# Altium schematic sheet altium.schdoc
size 226 x 97 mm
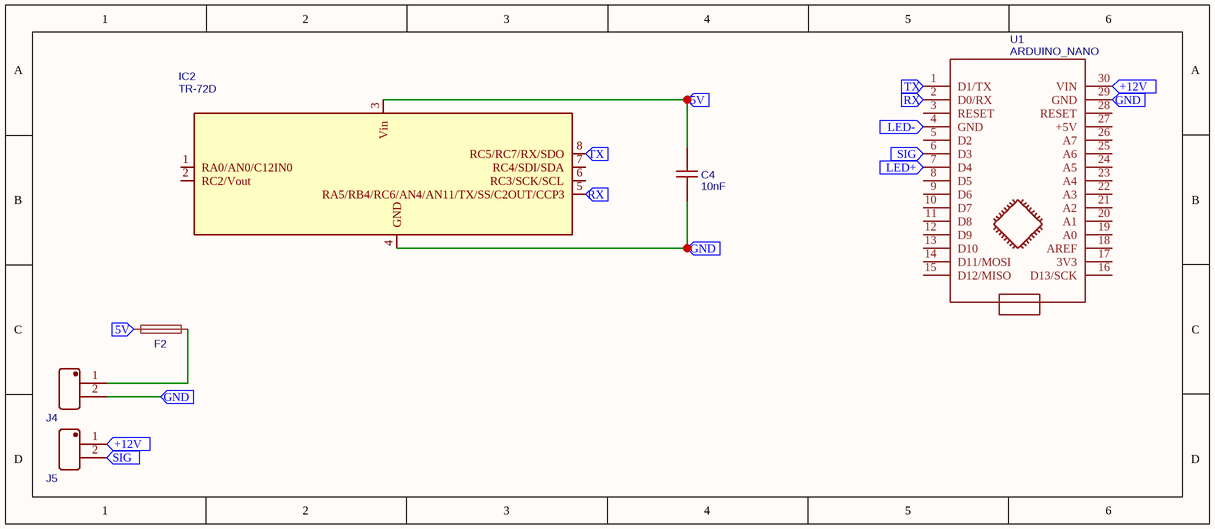
[diagram p0: altium.schdoc]

## Parts
C4  10nF  [0603]
F2  NO  [OMF_125]  (value not drawn)
IC2  TR-72D  [IQRF_KON-SIM-01]
J4  KF127_2P_5.08  [KF127_2P_5.08]  (value not drawn)
J5  KF127_2P_5.08  [KF127_2P_5.08]  (value not drawn)
U1  ARDUINO_NANO  [ARDUINO_NANO]

## Ports
5V, +12V, GND, LED+, LED-, RX, SIG, TX

## Nets
5V: C4.2 F2.1 IC2.3(Vin) ; port 5V
+12V: J5.1(PIN1) U1.30(VIN) ; port +12V
GND: C4.1 IC2.4(GND) J4.2(PIN2) U1.29(GND) ; port GND
LED+: U1.7(D4) ; port LED+
LED-: U1.4(GND) ; port LED-
RX: IC2.5(RA5/RB4/RC6/AN4/AN11/TX/SS/C2OUT/CCP3) U1.2(D0/RX) ; port RX
SIG: J5.2(PIN2) U1.6(D3) ; port SIG
TX: IC2.8(RC5/RC7/RX/SDO) U1.1(D1/TX) ; port TX
NetF2_2: F2.2 J4.1(PIN1)

Not connected (* = marked no-connect by the designer): IC2 1(RA0/AN0/C12IN0) 2(RC2/Vout) 6(RC3/SCK/SCL) 7(RC4/SDI/SDA); U1 3(RESET) 5(D2) 8(D5) 9(D6) 10(D7) 11(D8) 12(D9) 13(D10) 14(D11/MOSI) 15(D12/MISO) 16(D13/SCK) 17(3V3) 18(AREF) 19(A0) 20(A1) 21(A2) 22(A3) 23(A4) 24(A5) 25(A6) 26(A7) 27(+5V) 28(RESET)

## Library data of the parts
C4 = 10nF: BOM_Manufacturer: Guangdong Fenghua Advanced Tech; BOM_Manufacturer Part: 0603B103K500AT; nameAlias: Capacitance; Contributor: LCSC; BOM_Supplier: LCSC; BOM_Supplier Part: C327421; spicePre: C; spiceSymbolName: 0603B103K500AT
F2 = NO: BOM_Manufacturer Part: 3403.0015.11; Contributor: romiksm; BOM_Supplier: Mouser; BOM_Supplier Part: 693-3403.0015.11; link: https://www.mouser.co.uk/ProductDetail/Schurter/3403001511?qs=sGAEpiMZZMtxU2g%2f1juGqdRmCQF0%252bT4VUkZkHB0fJk4%3d; spicePre: F
IC2 = TR-72D: Contributor: Simen Stensas; license: https://www.gnu.org/licenses/lgpl-2.1.html; spicePre: I
J4 J5 = KF127_2P_5.08: BOM_Manufacturer: Kefa Electronics; BOM_Manufacturer Part: KF127L-5.08; Contributor: GrahamG; spicePre: J
U1 = ARDUINO_NANO: sourceId: KGSeAWhDB; timeStamp: 1452340004; spicePre: U